# Altium schematic sheet Incoming_connectors2.SchDoc
size A4
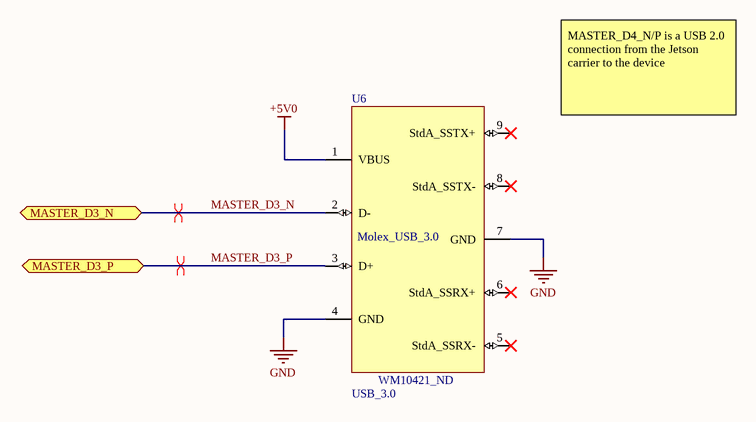
[diagram p0: Incoming_connectors2.SchDoc]

## Parts
U6  USB_3.0  [Molex_USB_3.0_WM10421_ND]

## Ports
MASTER_D3_N (bidir), MASTER_D3_P (bidir)

## Nets
+5V0: U6.1(VBUS)
GND: U6.4(GND) U6.7(GND)
MASTER_D3_N: U6.2(D-) ; port MASTER_D3_N
MASTER_D3_P: U6.3(D+) ; port MASTER_D3_P

Not connected (* = marked no-connect by the designer): U6 5(StdA_SSRX-)* 6(StdA_SSRX+)* 8(StdA_SSTX-)* 9(StdA_SSTX+)*

## Layout directives
differential pair; rule Signal Stimulus [Kind - Single Pulse    Level - High    Start Time = 0.000    Stop Time = 2.083n    Period Time = 4.167n]: MASTER_D3_N, MASTER_D3_P

## Notes on the sheet
- MASTER_D4_N/P is a USB 2.0  connection from the Jetson carrier to the device
- (in symbol Molex_USB_3.0_WM10421_ND) Molex_USB_3.0; WM10421_ND

## Library data of the parts
U6 = Molex_USB_3.0_WM10421_ND: USB 3.0 Type A Receptacle Connector 9 Position Through Hole; Manufacturer: Molex; Manufacturer Profuct #: 0484080003; Price (CAD): 1.98; ComponentLink1Description: Datasheet; ComponentLink1URL: media.digikey.com/pdf/Data%20Sheets/Molex%20PDFs/48408-001_Pkg%20Spec.pdf; ComponentLink2Description: Datasheet_Model; ComponentLink2URL: molex.com/pdm_docs/sd/484080003_sd.pdf